# Altium schematic sheet Sheet1.SchDoc
size A; SheetNumber: 1; SheetTotal: 1
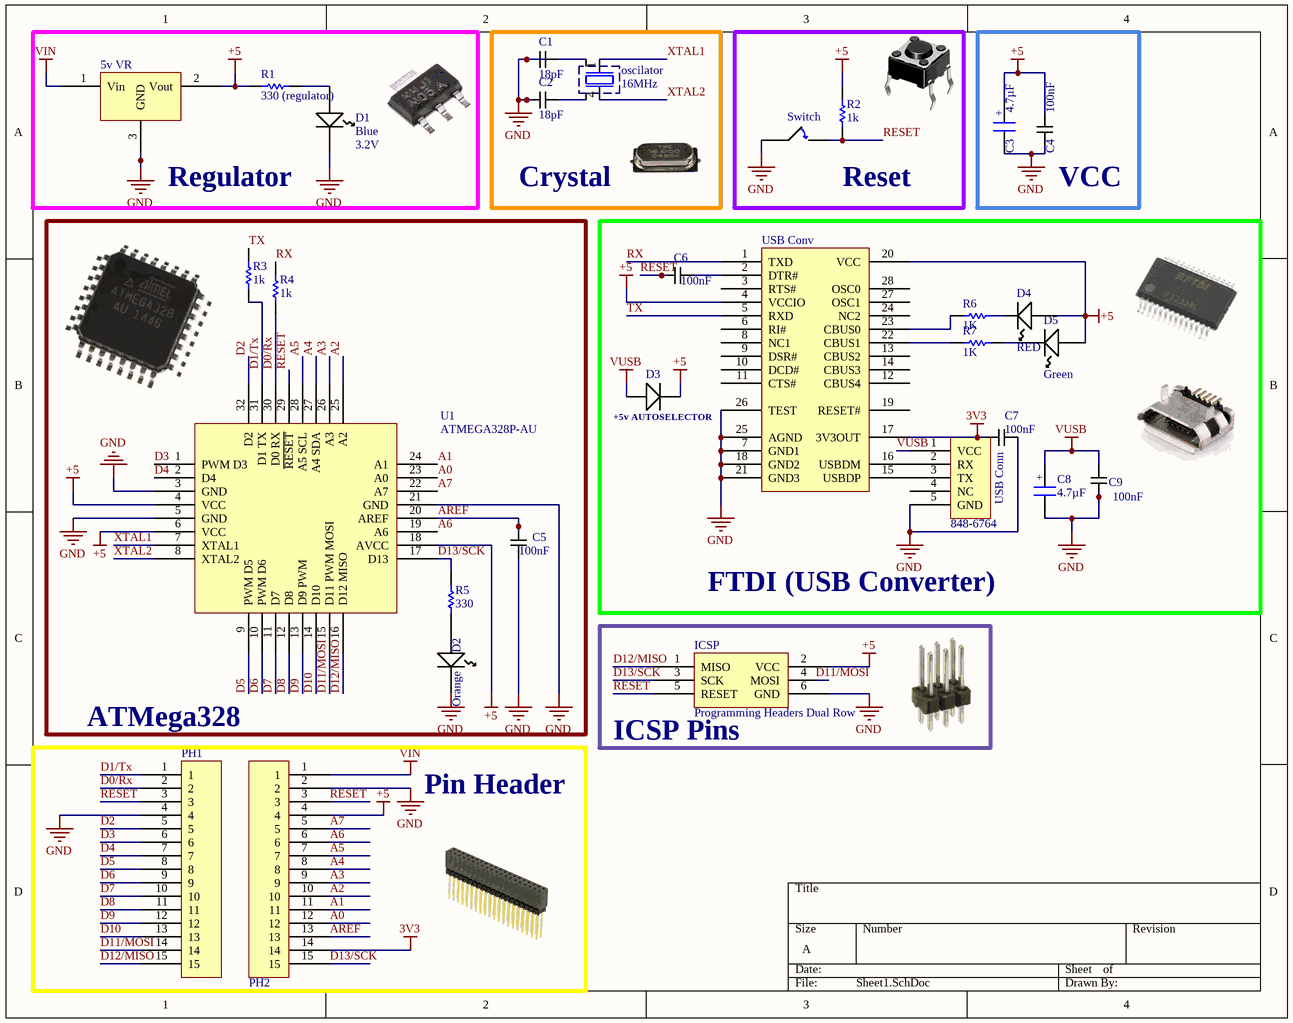
[diagram p0: Sheet1.SchDoc]

## Parts
5v_VR  LM1117MP-5.0/NOPB, Low Dropout Voltage Regulator, 1.5A, 5 V ±1%, 4-Pin SOT-223  [SOT230P700X180-4N]  (value not drawn)
C1  Capacitance: 18pF  [CAPCP2012X09N]  (hidden comment: C0805C180J5GACTU)
C2  Capacitance: 18pF  [CAPCP2012X09N]  (hidden comment: C0805C180J5GACTU)
C3  value 4.7µF  [CASE A - 3216X18]  (hidden comment: Capacitor SMT Tantalum)
C4  Capacitance: 100nF  [CAPCP2012X09N]  (hidden comment: 100nF Ceramic Multilayer Capacitor_1)
C5  Capacitance: 100nF  [CAPCP2012X09N]  (hidden comment: 100nF Ceramic Multilayer Capacitor_1)
C6  Capacitance: 100nF  [CAPCP2012X09N]  (hidden comment: 100nF Ceramic Multilayer Capacitor_1)
C7  Capacitance: 100nF  [CAPCP2012X09N]  (hidden comment: 100nF Ceramic Multilayer Capacitor_1)
C8  value 4.7µF  [CASE A - 3216X18]  (hidden comment: Capacitor SMT Tantalum)
C9  Capacitance: 100nF  [CAPCP2012X09N]  (hidden comment: 100nF Ceramic Multilayer Capacitor_1)
D1  Color: Blue  Forward Voltage: 3.2V  [LED1913X12NBLUE]  (hidden comment: (power)Kingbright Blue LED, 60 mcd 120 ° 0805)
D2  Color: Orange  [LED1913X12NYEL/ORANGE]  (hidden comment: (D13 led) Kingbright Orange LED, 200 mcd 120 ° 0805)
D3  Panasonic DB2J20900L Schottky Diode, 0.5A, 20V, 2.4ns, 2-Pin SMini2 F5 B  [DIOM1712X07N]  (value not drawn)
D4  Color: RED  [LED1913X12NRED]  (hidden comment: (TX)Kingbright Red LED, 100 mcd 120 ° 0805)
D5  Color: Green  [LED1913X12NGREEN]  (hidden comment: (RX)Kingbright Green LED, 70 mcd 120 ° 0805)
ICSP  Programming Headers Dual Row  [ISP HEADER]
oscilator  value 16MHz  [Aker S5C Crystal]  (hidden comment: Aker 16MHz Crystal SMT)
PH1  connector;str header;single row;.1 cont centers;.095 tail;gold or gtx;36 contact  [Header]  (value not drawn)
PH2  connector;str header;single row;.1 cont centers;.095 tail;gold or gtx;36 contact  [Header]  (value not drawn)
R1  330 (regulator)  [RESC1608X55X25NL10T15]
R2  1k  [RESC1608X55X25NL10T15]
R3  1k  [RESC1608X55X25NL10T15]
R4  1k  [RESC1608X55X25NL10T15]
R5  330  [RESC1608X55X25NL10T15]
R6  1K  [RESC1608X55X25NL10T15]
R7  1K  [RESC1608X55X25NL10T15]
Switch  Button Tactile Switch, NO 0.05 A 0.8mm  [Button8014X17N]  (value not drawn)
U1  ATMEGA328P-AU  [TQFP80P900X900X120-32N]
USB_Conn  RS Stock No: 848-6764  [MicroUSB]  (hidden comment: NewMolex Right Angle SMT Female Type B Micro USB Connector, 30 V ac, 1.8A)
USB_Conv  FT232RL, Universal Asynchronous Receiver & Transmitter 3MBd, 28-Pin, SSOP  [SOP65P780X200-28N]  (value not drawn)

## Blocks framed on the sheet
Regulator: 5v_VR D1 R1
Crystal: C1 C2 oscilator
Reset: R2 Switch
VCC: C3 C4
ATMega328: C5 D2 R3-R5 U1
FTDI (USB Converter): C6-C9 D3-D5 R6 R7 USB_Conn USB_Conv
ICSP Pins: ICSP

## Nets
3V3: C7.1 PH2.14 USB_Conv.17(3V3OUT)
+5: 5v_VR.2(Vout) C3.1 C4.2 D3.1 D4.1(A) D5.1(A) ICSP.2(VCC) PH2.4 R1.1 R2.2 U1.4(VCC) U1.6(VCC) U1.18(AVCC) USB_Conv.4(VCCIO) USB_Conv.20(VCC)
GND: 5v_VR.3(GND) C1.1 C2.1 C3.2 C4.1 C5.2 C7.2 C8.2 C9.1 D1.2(K) D2.2(K) ICSP.6(GND) PH1.4 PH2.2 Switch.2 U1.3(GND) U1.5(GND) U1.21(GND) USB_Conn.5(GND) USB_Conv.7(GND1) USB_Conv.18(GND2) USB_Conv.21(GND3) USB_Conv.25(AGND) USB_Conv.26(TEST)
VIN: 5v_VR.1(Vin) PH2.1
VUSB: C8.1 C9.2 D3.2 USB_Conn.1(VCC)
A0: PH2.12 U1.23(A0)
A1: PH2.11 U1.24(A1)
A2: PH2.10 U1.25(A2)
A3: PH2.9 U1.26(A3)
A4: PH2.8 U1.27(A4_SDA)
A5: PH2.7 U1.28(A5_SCL)
A6: PH2.6 U1.19(A6)
A7: PH2.5 U1.22(A7)
AREF: C5.1 PH2.13 U1.20(AREF)
D0/Rx: PH1.2 R4.1 U1.30(D0_RX)
D1/Tx: PH1.1 R3.1 U1.31(D1_TX)
D2: PH1.5 U1.32(D2)
D3: PH1.6 U1.1(PWM_D3)
D4: PH1.7 U1.2(D4)
D5: PH1.8 U1.9(PWM_D5)
D6: PH1.9 U1.10(PWM_D6)
D7: PH1.10 U1.11(D7)
D8: PH1.11 U1.12(D8)
D9: PH1.12 U1.13(D9_PWM)
D10: PH1.13 U1.14(D10)
D11/MOSI: ICSP.4(MOSI) PH1.14 U1.15(D11_PWM_MOSI)
D12/MISO: ICSP.1(MISO) PH1.15 U1.16(D12_MISO)
D13/SCK: ICSP.3(SCK) PH2.15 R5.2 U1.17(D13)
RESET: C6.1 ICSP.5(RESET) PH1.3 PH2.3 R2.1 Switch.1 U1.29(~{RESET})
RX: R4.2 USB_Conv.1(TXD)
TX: R3.2 USB_Conv.5(RXD)
XTAL1: oscilator.1 U1.7(XTAL1)
XTAL2: oscilator.4 U1.8(XTAL2)
NetC1_2: C1.2 oscilator.3(Gnd)
NetC2_2: C2.2 oscilator.2(Gnd)
NetC6_2: C6.2 USB_Conv.2(DTR#)
NetD1_1: D1.1(A) R1.2
NetD2_1: D2.1(A) R5.1
NetD4_2: D4.2(K) R6.1
NetD5_2: D5.2(K) R7.1
NetR6_2: R6.2 USB_Conv.23(CBUS0)
NetR7_2: R7.2 USB_Conv.22(CBUS1)
NetUSB_Conn_2: USB_Conn.2(RX) USB_Conv.16(USBDM)
NetUSB_Conn_3: USB_Conn.3(TX) USB_Conv.15(USBDP)

Not connected (* = marked no-connect by the designer): USB_Conn 4(NC); USB_Conv 3(RTS#) 6(RI#) 8(NC1) 9(DSR#) 10(DCD#) 11(CTS#) 12(CBUS4) 13(CBUS2) 14(CBUS3) 19(RESET#) 24(NC2) 27(OSC1) 28(OSC0)

## Notes on the sheet
- (near D3) +5v AUTOSELECTOR
- Pin Header
- (in symbol 4.7µF Tant RS 496-3545) +

## Library data of the parts
5v_VR = LM1117MP-5.0: Manufacturer: Texas Instruments; Supply Current: 1.5Amps; Output Voltage: 5V; Maximum Input Voltage: 15V; Date Created: 26 February 2015; Created By: R Kanjee; RS Stock No.: 533-9583; Datasheet URL: http://za.rs-online.com/web/p/low-dropout-voltage-regulators/5339583/
C1 C2 = 18pF Ceramic Multilayer Capacitor, 50 V dc C0G Dielectric ±5% SMD: Manufacturer: Kemet; Voltage: 50V; Creator: Ritesh Kanjee; Date Created: 18 February 2015; Package: 0805; RS Stock No.: 648-0935; Datasheet URL: http://za.rs-online.com/web/p/ceramic-multilayer-capacitors/6480935/?searchTerm=C0805C180J5GACTU&relevancy-data=636F3D3226696E3D4931384E4B6E6F776E41734D504E266C753D656E266D6D3D6D61746368616C6C7061727469616C26706D3D5E5B5C707B4C7D5C707B4E647D2D2C2F255C2E5D2B2426706F3D313326736E3D592673743D4D414E5F504152545F4E554D4245522677633D424F5448267573743D4330383035433138304A35474143545526
C3 C8 = 4.7µF Tant RS 496-3545: Capacitor,tantalum,SMT,16V,4.7uF,10%,A-case; Part Originator: H Theron; RS Stock Nr.: 496-3545; Tolerance: 10%; Package: 3216-18; Publisher: DPSS; LatestRevisionDate: 28-April-2010; ComponentLink1Description: Supplier Website; ComponentLink1URL: http://za.rs-online.com/web/search/searchBrowseAction.html?method=getProduct&R=4963545; ComponentLink2Description: RS Data sheet; ComponentLink2URL: http://docs-europe.origin.electrocomponents.com/webdocs/04ed/0900766b804ed4cc.pdf; Voltage: 16V
C4-C7 C9 = 100nF Ceramic Multilayer Capacitor_1: AVX 0805 Standard 100nF Ceramic Multilayer Capacitor, 50 V dc X7R Dielectric ±10% SMD; Voltage: 50V; Creator: Ritesh Kanjee; Date Created: 18 February 2015; Package: 0805; Manufacturer: AVX; RS Stock No.: 464-6688; Datasheet URL: http://za.rs-online.com/web/p/ceramic-multilayer-capacitors/4646688/
D1 = Kingbright Blue LED, 60 mcd 120 ° 0805: Manufacturer Part No.: KP-2012PBC-A; Creator: Ritesh Kanjee; Date Created: 18 February 2015; Manufacturer: KingBright; RS Stock No.: 466-3784; Datasheet URL: http://za.rs-online.com/web/p/visible-leds/4663784/
D2 = Kingbright Orange LED, 200 mcd 120 ° 0805: Manufacturer Part No.: KP-2012SEC; Forward Voltage: 1.85V; Creator: Ritesh Kanjee; Date Created: 18 February 2015; Manufacturer: KingBright; RS Stock No.: 466-3790; Datasheet URL: http://za.rs-online.com/web/p/visible-leds/4663790/
D3 = Schottky Diode, 0.5A, 20V, 2.4ns, 2-Pin SMini2 F5 B: Created By: R Kanjee; Date Created: 1 March 2015; Manufacturer: Panasonic; RS Stock No.: 713-2703; Manufacturer Part No.: DB2J20900L; Datasheet: http://docs-europe.electrocomponents.com/webdocs/1398/0900766b813986b3.pdf; Maximum Continuous Forward Current: 0.5A; Peak Reverse Repetitive Voltage: 20V
D4 = Kingbright Red LED, 100 mcd 120 ° 0805: Manufacturer Part No.: KP-2012SRC-PRV; Forward Voltage: 1.85V; Creator: Ritesh Kanjee; Date Created: 18 February 2015; Manufacturer: KingBright; RS Stock No.: 466-3813; Datasheet URL: http://za.rs-online.com/web/p/visible-leds/4663813/
D5 = Kingbright Green LED, 70 mcd 120 ° 0805: Manufacturer Part No.: KP-2012MGC; Forward Voltage: 2.1 V; Creator: Ritesh Kanjee; Date Created: 18 February 2015; Manufacturer: KingBright; RS Stock No.: 466-3778; Datasheet URL: http://za.rs-online.com/web/p/visible-leds/4663778/
ICSP = Programming ISP, Programming Headers Dual Row: Manufacturer: FCI; Manufacturer Part No.: 68000-236HLF; Current Rating: 3Amps Continuous; Created By: R Kanjee; Date Created: 1 March 2015; RS Stock No.: 2509565626
oscilator = Aker  C5S-16.000-12-3030-X: Aker S5C SMT Crystal; Load Capacitance: 12pF; Frequency Stability: +/-30ppm; RS: RS 671-9488; Creator: R Kanjee; Manufacturer: Aker; Manufacturer Part #: C5S-16.000-12-3030-X; Supplier: RS; RS Stock Nr.: 671-9488; HelpURL: http://za.rs-online.com/web/p/crystal-units/6719488/; Package: 3.2x5mm SMD
PH1 PH2 = Single row; PCB headers: Manufacturer: FCI; Manufacturer Part No.: 68000-236HLF; Current Rating: 3Amps Continuous; Created By: R Kanjee; Date Created: 1 March 2015; RS Stock No.: 2509565626
R1 R5 = CMP-2100-03667-1: Chip Resistor, 0 Ohm, +/- 5%, 0.1 W, -55 to 155 degC, 0603 (1608 Metric), RoHS, Tape and Reel; Manufacturer: Yageo; Temperature Coefficient: 200ppm/degreesC; Voltage Rating: 50V; Power Rating: 100mW; Resistance: 330mOhm; Width: 0.8mm; Max Operating Temperature: 155degC; Tolerance: 5%; Package Reference: 0603; Height: 0.45mm; Depth: 0.8mm; Package Description: 2-Pin Surface Mount Device, Body 1.6 x 0.8 mm; Termination: SMD/SMT; Package Quantity: 5000; Case/Package: 0603; Case Code (Imperial): 0603; Radiation Hardening: No; Number of Pins: 2; Length: 1.6mm; Lead Free: LeadFree; Voltage Rating (DC): 50V; Military Standard: Not; Datasheet URL: http://www.yageo.com/NewPortal/yageodocoutput?fileName=/pdf/R-Chip/PYu-RC_Group_51_RoHS_L_5.pdf; Manufacturer URL: http://www.yageo.com/; Packaging: TapeandReel; Case Code (Metric): 1608; Min Operating Temperature: -55degC; Composition: ThickFilm; RoHSCompliant: true; Contact Plating: Tin; Datasheet Version: Rev. 5, 10/2016; REACH SVHC: NoSVHC
R2-R4 R6 R7 = CMP-2100-03667-1: Chip Resistor, 0 Ohm, +/- 5%, 0.1 W, -55 to 155 degC, 0603 (1608 Metric), RoHS, Tape and Reel; Manufacturer: Yageo; Temperature Coefficient: 200ppm/degreesC; Voltage Rating: 50V; Power Rating: 100mW; Width: 0.8mm; Max Operating Temperature: 155degC; Tolerance: 5%; Package Reference: 0603; Height: 0.45mm; Depth: 0.8mm; Package Description: 2-Pin Surface Mount Device, Body 1.6 x 0.8 mm; Termination: SMD/SMT; Package Quantity: 5000; Case/Package: 0603; Case Code (Imperial): 0603; Radiation Hardening: No; Number of Pins: 2; Length: 1.6mm; Lead Free: LeadFree; Voltage Rating (DC): 50V; Military Standard: Not; Datasheet URL: http://www.yageo.com/NewPortal/yageodocoutput?fileName=/pdf/R-Chip/PYu-RC_Group_51_RoHS_L_5.pdf; Resistance: 1K; Manufacturer URL: http://www.yageo.com/; Packaging: TapeandReel; Case Code (Metric): 1608; Min Operating Temperature: -55degC; Composition: ThickFilm; RoHSCompliant: true; Contact Plating: Tin; Datasheet Version: Rev. 5, 10/2016; REACH SVHC: NoSVHC
Switch = Button Tactile Switch, NO 0.05 A 0.8mm: Manufacturer: C & K; Manufacturer Part No.: B3F1000; State: Normaly Open; Date Created: 25 February 2015; Creator: R Kanjee; RS Stock No.: 516-255
U1 = ATMEGA328P-AU: ATMEGA328P-AU, 8 bit AVR Microcontroller 20MHz 1 kB, 32 kB Flash, 2 kB RAM, I2C 32-Pin TQFP; Company: Lumina Inova; Created By: Ritesh Kanjee; Date Created: 14 February 2015; RS Stock No.: 696-3092; Datasheet URL: http://docs-europe.electrocomponents.com/webdocs/0db4/0900766b80db4deb.pdf
USB_Conn = Micro USB Connector, 30 V ac, 1.8A: Manufacturer: Molex; Manufacturer Part No.: 105017-0001; Max Voltage: 30V; Creator: R Kanjee; Date Created: 28 February 2015; Datasheet URL: http://za.rs-online.com/web/p/micro-usb-connectors/8486764/; Max Current: 1.8A
USB_Conv = FT232RL USB to UART, Universal Asynchronous Receiver & Transmitter 3MBd, 28-Pin, SSOP: Manufacturer: FTDI Chip; Creator: R Kanjee; Date Created: 03 March 2015; Manufacturer Part No.: FT232RL; RS Stock No.: 406-580; Pin Count: 28